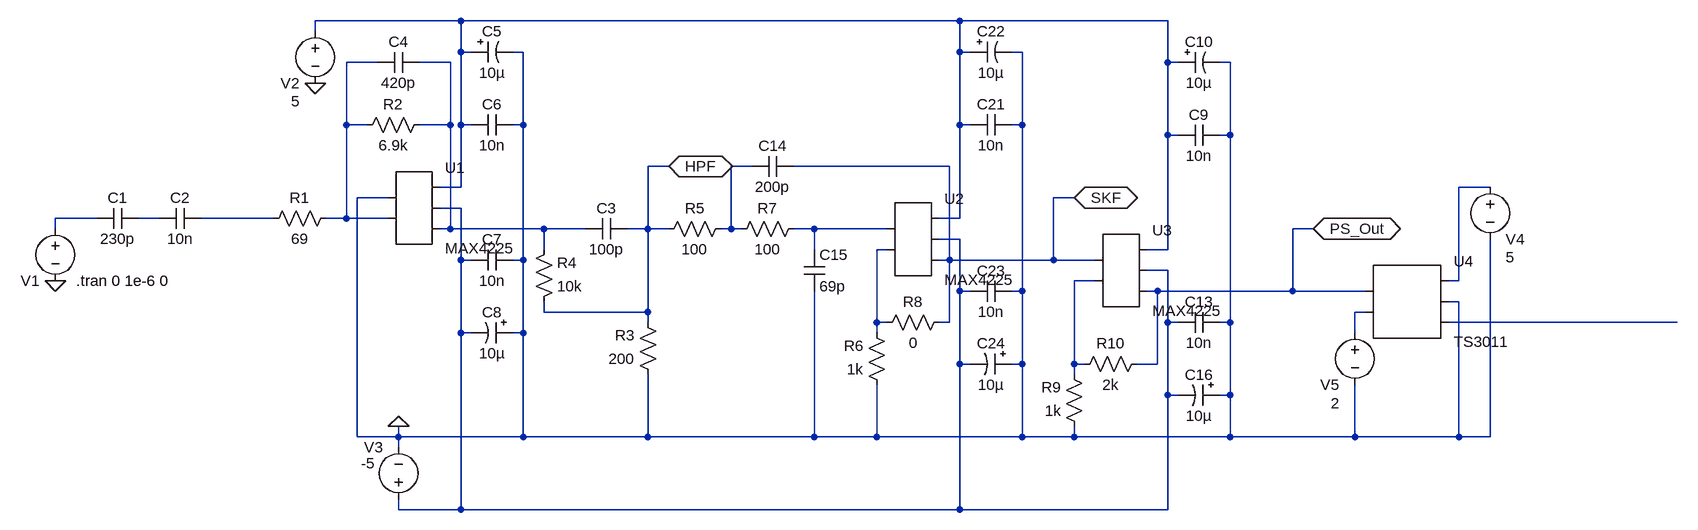
[diagram p0: schematic combined-pulser-CSP-PS.asc]
combined-pulser-CSP-PS.asc, the LTspice schematic file:
Version 4
SHEET 1 8136 1524
WIRE 112 -240 -112 -240
WIRE 880 -240 112 -240
WIRE 1200 -240 880 -240
WIRE -112 -224 -112 -240
WIRE 112 -192 112 -240
WIRE 128 -192 112 -192
WIRE 208 -192 192 -192
WIRE 880 -192 880 -240
WIRE 896 -192 880 -192
WIRE 976 -192 960 -192
WIRE -16 -176 -64 -176
WIRE 96 -176 48 -176
WIRE 1200 -176 1200 -240
WIRE 1216 -176 1200 -176
WIRE 1296 -176 1280 -176
WIRE -64 -80 -64 -176
WIRE -32 -80 -64 -80
WIRE 96 -80 96 -176
WIRE 96 -80 48 -80
WIRE 112 -80 112 -192
WIRE 128 -80 112 -80
WIRE 208 -80 208 -192
WIRE 208 -80 192 -80
WIRE 880 -80 880 -192
WIRE 896 -80 880 -80
WIRE 976 -80 976 -192
WIRE 976 -80 960 -80
WIRE 1200 -64 1200 -176
WIRE 1216 -64 1200 -64
WIRE 1296 -64 1296 -176
WIRE 1296 -64 1280 -64
WIRE 432 -16 400 -16
WIRE 560 -16 528 -16
WIRE 864 -16 624 -16
WIRE 112 16 112 -80
WIRE 112 16 80 16
WIRE 1696 16 1648 16
WIRE 0 32 -48 32
WIRE 1056 32 1024 32
WIRE 112 48 80 48
WIRE -448 64 -512 64
WIRE -352 64 -384 64
WIRE -176 64 -288 64
WIRE -64 64 -64 -80
WIRE -64 64 -96 64
WIRE 0 64 -64 64
WIRE 880 64 880 -80
WIRE 880 64 848 64
WIRE -512 80 -512 64
WIRE 96 80 96 -80
WIRE 96 80 80 80
WIRE 240 80 96 80
WIRE 304 80 240 80
WIRE 400 80 400 -16
WIRE 400 80 368 80
WIRE 432 80 400 80
WIRE 528 80 528 -16
WIRE 528 80 512 80
WIRE 544 80 528 80
WIRE 656 80 624 80
WIRE 768 80 656 80
WIRE 1424 80 1392 80
WIRE 880 96 848 96
WIRE 240 112 240 80
WIRE 656 112 656 80
WIRE 768 112 752 112
WIRE 1200 112 1200 -64
WIRE 1200 112 1168 112
WIRE 112 128 112 48
WIRE 128 128 112 128
WIRE 208 128 208 -80
WIRE 208 128 192 128
WIRE 864 128 864 -16
WIRE 864 128 848 128
WIRE 1024 128 1024 32
WIRE 1024 128 864 128
WIRE 1088 128 1024 128
WIRE 1200 144 1168 144
WIRE 1088 160 1056 160
WIRE 1648 160 1648 16
WIRE 1648 160 1632 160
WIRE 880 176 880 96
WIRE 896 176 880 176
WIRE 976 176 976 -80
WIRE 976 176 960 176
WIRE 1184 176 1168 176
WIRE 1392 176 1392 80
WIRE 1392 176 1184 176
WIRE 1504 176 1392 176
WIRE 1648 192 1632 192
WIRE 240 208 240 192
WIRE 400 208 400 80
WIRE 400 208 240 208
WIRE 1504 208 1488 208
WIRE 400 224 400 208
WIRE 752 224 752 112
WIRE 768 224 752 224
WIRE 864 224 864 128
WIRE 864 224 848 224
WIRE 1200 224 1200 144
WIRE 1216 224 1200 224
WIRE 1296 224 1296 -64
WIRE 1296 224 1280 224
WIRE 1984 224 1632 224
WIRE 112 240 112 128
WIRE 128 240 112 240
WIRE 208 240 208 128
WIRE 208 240 192 240
WIRE 752 240 752 224
WIRE 1488 240 1488 208
WIRE 880 288 880 176
WIRE 896 288 880 288
WIRE 976 288 976 176
WIRE 976 288 960 288
WIRE 1056 288 1056 160
WIRE 1072 288 1056 288
WIRE 1184 288 1184 176
WIRE 1184 288 1152 288
WIRE 1056 304 1056 288
WIRE 1200 336 1200 224
WIRE 1216 336 1200 336
WIRE 1296 336 1296 224
WIRE 1296 336 1280 336
WIRE -48 400 -48 32
WIRE 16 400 16 384
WIRE 16 400 -48 400
WIRE 208 400 208 240
WIRE 208 400 16 400
WIRE 400 400 400 304
WIRE 400 400 208 400
WIRE 656 400 656 176
WIRE 656 400 400 400
WIRE 752 400 752 320
WIRE 752 400 656 400
WIRE 976 400 976 288
WIRE 976 400 752 400
WIRE 1056 400 1056 384
WIRE 1056 400 976 400
WIRE 1296 400 1296 336
WIRE 1296 400 1056 400
WIRE 1488 400 1488 320
WIRE 1488 400 1296 400
WIRE 1648 400 1648 192
WIRE 1648 400 1488 400
WIRE 1696 400 1696 96
WIRE 1696 400 1648 400
WIRE 16 416 16 400
WIRE 16 512 16 496
WIRE 112 512 112 240
WIRE 112 512 16 512
WIRE 880 512 880 288
WIRE 880 512 112 512
WIRE 1200 512 1200 336
WIRE 1200 512 880 512
FLAG -112 -144 0
FLAG -512 160 0
FLAG 16 384 0
FLAG 1424 80 PS_Out
IOPIN 1424 80 BiDir
FLAG 432 -16 HPF
IOPIN 432 -16 BiDir
FLAG 1056 32 SKF
IOPIN 1056 32 BiDir
SYMBOL res -80 48 R90
WINDOW 0 0 56 VBottom 2
WINDOW 3 32 56 VTop 2
SYMATTR InstName R1
SYMATTR Value 69
SYMBOL cap -384 48 R90
WINDOW 0 0 32 VBottom 2
WINDOW 3 32 32 VTop 2
SYMATTR InstName C1
SYMATTR Value 230p
SYMBOL voltage -112 -240 M0
WINDOW 0 24 96 Left 2
WINDOW 3 24 124 Left 2
WINDOW 123 0 0 Left 2
WINDOW 39 24 152 Left 2
SYMATTR InstName V2
SYMATTR Value 5
SYMBOL res 64 -96 R90
WINDOW 0 0 56 VBottom 2
WINDOW 3 32 56 VTop 2
SYMATTR InstName R2
SYMATTR Value 6.9k
SYMBOL cap 48 -192 R90
WINDOW 0 0 32 VBottom 2
WINDOW 3 32 32 VTop 2
SYMATTR InstName C4
SYMATTR Value 420p
SYMBOL voltage -512 64 M0
WINDOW 0 24 96 Left 2
WINDOW 3 24 124 Invisible 2
WINDOW 123 24 152 Left 2
WINDOW 39 24 152 Left 2
SYMATTR InstName V1
SYMATTR Value PULSE(35 26.9 0 1e-9 300e-9 0 1e-6)
SYMBOL cap -288 48 R90
WINDOW 0 0 32 VBottom 2
WINDOW 3 32 32 VTop 2
SYMATTR InstName C2
SYMATTR Value 10n
SYMBOL cap 192 -96 R90
WINDOW 0 0 32 VBottom 2
WINDOW 3 32 32 VTop 2
SYMATTR InstName C6
SYMATTR Value 10n
SYMBOL cap 192 144 M270
WINDOW 0 32 32 VTop 2
WINDOW 3 0 32 VBottom 2
SYMATTR InstName C7
SYMATTR Value 10n
SYMBOL polcap 128 -208 M90
WINDOW 0 0 32 VBottom 2
WINDOW 3 32 32 VTop 2
SYMATTR InstName C5
SYMATTR Value 10µ
SYMBOL polcap 192 224 R90
WINDOW 0 0 32 VBottom 2
WINDOW 3 32 32 VTop 2
SYMATTR InstName C8
SYMATTR Value 10µ
SYMBOL voltage 16 512 R180
WINDOW 0 24 96 Left 2
WINDOW 3 36 71 Left 2
WINDOW 123 0 0 Left 2
WINDOW 39 24 152 Left 2
SYMATTR InstName V3
SYMATTR Value -5
SYMBOL AutoGenerated\\MAX4225 32 48 R0
SYMATTR InstName U1
SYMBOL res 416 320 R180
WINDOW 0 36 76 Left 2
WINDOW 3 36 40 Left 2
SYMATTR InstName R3
SYMATTR Value 200
SYMBOL cap 368 64 R90
WINDOW 0 0 32 VBottom 2
WINDOW 3 32 32 VTop 2
SYMATTR InstName C3
SYMATTR Value 100p
SYMBOL res 528 64 R90
WINDOW 0 0 56 VBottom 2
WINDOW 3 32 56 VTop 2
SYMATTR InstName R5
SYMATTR Value 100
SYMBOL res 768 336 R180
WINDOW 0 36 76 Left 2
WINDOW 3 36 40 Left 2
SYMATTR InstName R6
SYMATTR Value 1k
SYMBOL cap 624 -32 R90
WINDOW 0 0 32 VBottom 2
WINDOW 3 32 32 VTop 2
SYMATTR InstName C14
SYMATTR Value 200p
SYMBOL res 640 64 R90
WINDOW 0 0 56 VBottom 2
WINDOW 3 32 56 VTop 2
SYMATTR InstName R7
SYMATTR Value 100
SYMBOL cap 640 112 R0
SYMATTR InstName C15
SYMATTR Value 69p
SYMBOL AutoGenerated\\MAX4225 800 96 R0
SYMATTR InstName U2
SYMBOL res 752 240 R270
WINDOW 0 32 56 VTop 2
WINDOW 3 0 56 VBottom 2
SYMATTR InstName R8
SYMATTR Value 0
SYMBOL cap 960 -96 R90
WINDOW 0 0 32 VBottom 2
WINDOW 3 32 32 VTop 2
SYMATTR InstName C21
SYMATTR Value 10n
SYMBOL polcap 896 -208 M90
WINDOW 0 0 32 VBottom 2
WINDOW 3 32 32 VTop 2
SYMATTR InstName C22
SYMATTR Value 10µ
SYMBOL cap 960 192 M270
WINDOW 0 32 32 VTop 2
WINDOW 3 0 32 VBottom 2
SYMATTR InstName C23
SYMATTR Value 10n
SYMBOL polcap 960 272 R90
WINDOW 0 0 32 VBottom 2
WINDOW 3 32 32 VTop 2
SYMATTR InstName C24
SYMATTR Value 10µ
SYMBOL res 224 208 M180
WINDOW 0 36 76 Left 2
WINDOW 3 36 40 Left 2
SYMATTR InstName R4
SYMATTR Value 10k
SYMBOL cap 1280 -80 R90
WINDOW 0 0 32 VBottom 2
WINDOW 3 32 32 VTop 2
SYMATTR InstName C9
SYMATTR Value 10n
SYMBOL polcap 1216 -192 M90
WINDOW 0 0 32 VBottom 2
WINDOW 3 32 32 VTop 2
SYMATTR InstName C10
SYMATTR Value 10µ
SYMBOL cap 1280 240 M270
WINDOW 0 32 32 VTop 2
WINDOW 3 0 32 VBottom 2
SYMATTR InstName C13
SYMATTR Value 10n
SYMBOL polcap 1280 320 R90
WINDOW 0 0 32 VBottom 2
WINDOW 3 32 32 VTop 2
SYMATTR InstName C16
SYMATTR Value 10µ
SYMBOL AutoGenerated\\TS3011 1568 192 R0
SYMATTR InstName U4
SYMBOL voltage 1696 0 R0
WINDOW 0 24 96 Left 2
WINDOW 3 24 124 Left 2
WINDOW 123 0 0 Left 2
WINDOW 39 24 152 Left 2
SYMATTR InstName V4
SYMATTR Value 5
SYMBOL voltage 1488 224 M0
WINDOW 0 24 96 Left 2
WINDOW 3 24 124 Left 2
WINDOW 123 0 0 Left 2
WINDOW 39 24 152 Left 2
SYMATTR InstName V5
SYMATTR Value 2
SYMBOL AutoGenerated\\MAX4225 1120 144 R0
SYMATTR InstName U3
SYMBOL res 1072 400 R180
WINDOW 0 36 76 Left 2
WINDOW 3 36 40 Left 2
SYMATTR InstName R9
SYMATTR Value 1k
SYMBOL res 1056 304 R270
WINDOW 0 32 56 VTop 2
WINDOW 3 0 56 VBottom 2
SYMATTR InstName R10
SYMATTR Value 2k
TEXT -480 160 Left 2 !.tran 0 1e-6 0

The netlist it stands for:
* combined-pulser-CSP-PS.asc
R1 N002 N009 69
C1 N008 N007 230p
V2 N001 0 5
R2 N003 N002 6.9k
C4 N003 N002 420p
V1 N007 0 PULSE(35 26.9 0 1e-9 300e-9 0 1e-6)
C2 N009 N008 10n
C6 0 N001 10n
C7 0 N006 10n
C5 N001 0 10µ
C8 0 N006 10µ
V3 N006 0 -5
* U1: MAX4225 (symbol AutoGenerated\MAX4225 not available, pins judged from their places): pin1=0 pin2=N002 pin3=N001 pin4=N006 pin5=N003
R3 0 HPF 200
C3 HPF N003 100p
R5 N004 HPF 100
R6 0 N011 1k
C14 SKF N004 200p
R7 N010 N004 100
C15 N010 0 69p
* U2: MAX4225 (symbol AutoGenerated\MAX4225 not available, pins judged from their places): pin1=N010 pin2=N011 pin3=N001 pin4=N006 pin5=SKF
R8 N011 SKF 0
C21 0 N001 10n
C22 N001 0 10µ
C23 0 N006 10n
C24 0 N006 10µ
R4 HPF N003 10k
C9 0 N001 10n
C10 N001 0 10µ
C13 0 N006 10n
C16 0 N006 10µ
* U4: TS3011 (symbol AutoGenerated\TS3011 not available, pins judged from their places): pin1=PS_Out pin2=N013 pin3=N005 pin4=0 pin5=N014
V4 N005 0 5
V5 N013 0 2
* U3: MAX4225 (symbol AutoGenerated\MAX4225 not available, pins judged from their places): pin1=SKF pin2=N012 pin3=N001 pin4=N006 pin5=PS_Out
R9 0 N012 1k
R10 N012 PS_Out 2k
.tran 0 1e-6 0
.backanno
.end